# EAGLE design SP (EAGLE 9.4.2)
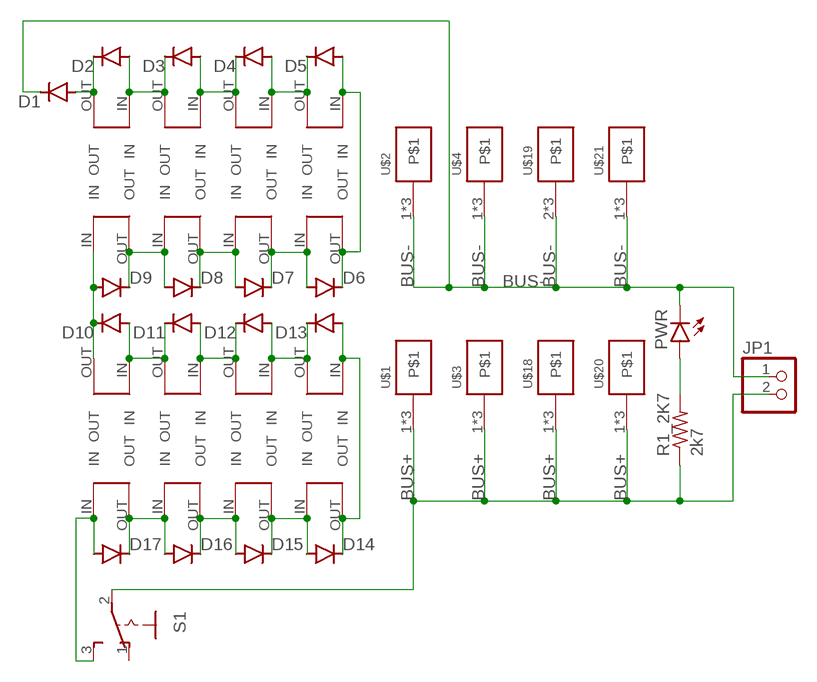
[diagram p0: schematic, sheet 1]

## Parts
D1  MBR0520LT  [SOD123]
D2  MBR0520LT  [SOD123]
D3  MBR0520LT  [SOD123]
D4  MBR0520LT  [SOD123]
D5  MBR0520LT  [SOD123]
D6  MBR0520LT  [SOD123]
D7  MBR0520LT  [SOD123]
D8  MBR0520LT  [SOD123]
D9  MBR0520LT  [SOD123]
D10  MBR0520LT  [SOD123]
D11  MBR0520LT  [SOD123]
D12  MBR0520LT  [SOD123]
D13  MBR0520LT  [SOD123]
D14  MBR0520LT  [SOD123]
D15  MBR0520LT  [SOD123]
D16  MBR0520LT  [SOD123]
D17  MBR0520LT  [SOD123]
JP1  PINHD-1X2  [1X02]
PWR  LEDCHIPLED_0603  [CHIPLED_0603]
R1_2K7  2k7  R-US_R0603  [R0603]
S1  255SB  [255SB]
SOL1  SOLAR_0  [SOLAR_0]
SOL2  SOLAR_0  [SOLAR_0]
SOL3  SOLAR_0  [SOLAR_0]
SOL4  SOLAR_1  [SOLAR_1]
SOL5  SOLAR_0  [SOLAR_0]
SOL6  SOLAR_0  [SOLAR_0]
SOL7  SOLAR_0  [SOLAR_0]
SOL8  SOLAR_1  [SOLAR_1]
SOL9  SOLAR_0  [SOLAR_0]
SOL10  SOLAR_0  [SOLAR_0]
SOL11  SOLAR_0  [SOLAR_0]
SOL12  SOLAR_1  [SOLAR_1]
SOL13  SOLAR_0  [SOLAR_0]
SOL14  SOLAR_0  [SOLAR_0]
SOL15  SOLAR_0  [SOLAR_0]
SOL16  SOLAR_1  [SOLAR_1]
U$1  KCONNECT3  [KCONNECT-3]
U$2  KCONNECT3  [KCONNECT-3]
U$3  KCONNECT4  [KCONNECT-4]
U$4  KCONNECT4  [KCONNECT-4]
U$18  KCONNECT4  [KCONNECT-4]
U$19  KCONNECT1  [KCONNECT-1]
U$20  KCONNECT3  [KCONNECT-3]
U$21  KCONNECT3  [KCONNECT-3]

## Nets
BUS+: JP1.2 R1_2K7.1 S1.2(P) U$1.1 U$1.2 U$1.4 U$3.1 U$3.2 U$3.3 U$18.1 U$18.2 U$18.3 U$20.1 U$20.2 U$20.4
BUS-: D1.C JP1.1 PWR.C U$2.1 U$2.2 U$2.4 U$4.1 U$4.2 U$4.3 U$19.2 U$19.3 U$19.4 U$21.1 U$21.2 U$21.4
N$1: D16.A D17.C SOL1.OUT SOL2.IN
N$3: D15.A D16.C SOL2.OUT SOL3.IN
N$4: D1.A D2.C SOL16.OUT
N$5: PWR.A R1_2K7.2
N$6: D14.A D15.C SOL3.OUT SOL4.IN
N$7: D17.A S1.3(S) SOL1.IN
N$8: D12.A D13.C SOL5.OUT SOL6.IN
N$9: D11.A D12.C SOL6.OUT SOL7.IN
N$10: D10.A D11.C SOL7.OUT SOL8.IN
N$11: D9.A D10.C SOL8.OUT SOL9.IN
N$12: D8.A D9.C SOL9.OUT SOL10.IN
N$13: D7.A D8.C SOL10.OUT SOL11.IN
N$14: D6.A D7.C SOL11.OUT SOL12.IN
N$15: D5.A D6.C SOL12.OUT SOL13.IN
N$16: D4.A D5.C SOL13.OUT SOL14.IN
N$17: D3.A D4.C SOL14.OUT SOL15.IN
N$18: D2.A D3.C SOL15.OUT SOL16.IN
N$24: D13.A D14.C SOL4.OUT SOL5.IN
Unconnected: S1.1(O)

## Library data of the parts
D1-D17 = diode:MBR0520LT: SCHOTTKY BARRIER RECTIFIER Source: http://onsemi.com .. MBR0520LT1-D.pdf
JP1 = pinhead:PINHD-1X2: PIN HEADER
PWR = led:LED: LED OSRAM: - CHIPLED LG R971, LG N971, LY N971, LG Q971, LY Q971, LO R971, LY R971 LH N974, LH R974 LS Q976, LO Q976, LY Q976 LO Q996 - Hyper CHIPLED LW Q18S LB Q993, LB Q99A, LB R99A - SideLED LS A670, LO A670, LY A670, LG A670, LP A670 LB A673, LV A673, LT A673, LW A673 LH A674 LY A675 LS A676, LA A676, LO A676, LY A676, LW A676 LS A679, LY A679, LG A679 - Hyper Micro SIDELED® LS Y876, LA Y876, LO Y876, LY Y876 LT Y87S - SmartLED LW L88C, LW L88S LB L89C, LB L89S, LG L890 LS L89K, LO L89K, LY L89K LS L896, LA L896, LO L896, LY L896 - TOPLED LS T670, LO T670, LY T670, LG T670, LP T670 LSG T670, LSP T670, LSY T670, LOP T670, LYG T670 LG T671, LOG T671, LSG T671 LB T673, LV T673, LT T673, LW T673 LH T674 LS T676, LA T676, LO T676, LY T676, LB T676, LH T676, LSB T676, LW T676 LB T67C, LV T67C, LT T67C, LS T67K, LO T67K, LY T67K, LW E67C LS E67B, LA E67B, LO E67B, LY E67B, LB E67C, LV E67C, LT E67C LW T67C LS T679, LY T679, LG T679 LS T770, LO T770, LY T770, LG T770, LP T770 LB T773, LV T773, LT T773, LW T773 LH T774 LS E675, LA E675, LY E675, LS T675 LS T776, LA T776, LO T776, LY T776, LB T776 LHGB T686 LT T68C, LB T68C - Hyper Mini TOPLED® LB M676 - Mini TOPLED Santana® LG M470 LS M47K, LO M47K, LY M47K Source: http://www.osram.convergy.de LUXEON: - LUMILED® LXK2-PW12-R00, LXK2-PW12-S00, LXK2-PW14-U00, LXK2-PW14-V00 LXK2-PM12-R00, LXK2-PM12-S00, LXK2-PM14-U00 LXK2-PE12-Q00, LXK2-PE12-R00, LXK2-PE12-S00, LXK2-PE14-T00, LXK2-PE14-U00 LXK2-PB12-K00, LXK2-PB12-L00, LXK2-PB12-M00, LXK2-PB14-N00, LXK2-PB14-P00, LXK2-PB14-Q00 LXK2-PR12-L00, LXK2-PR12-M00, LXK2-PR14-Q00, LXK2-PR14-R00 LXK2-PD12-Q00, LXK2-PD12-R00, LXK2-PD12-S00 LXK2-PH12-R00, LXK2-PH12-S00 LXK2-PL12-P00, LXK2-PL12-Q00, LXK2-PL12-R00 Source: www.luxeon.com KINGBRIGHT: KA-3528ASYC Source: www.kingbright.com
R1_2K7 = rcl:R-US_: RESISTOR, American symbol; SPICEPREFIX: R
S1 = CanCubeSat:255SB: SLIDING SWITCH Distributor Buerklin, 11G810
SOL1-SOL16 = CanCubeSat:SOLAR
U$1-U$4 U$18-U$21 = CanCubeSat:KCONNECT

## Board
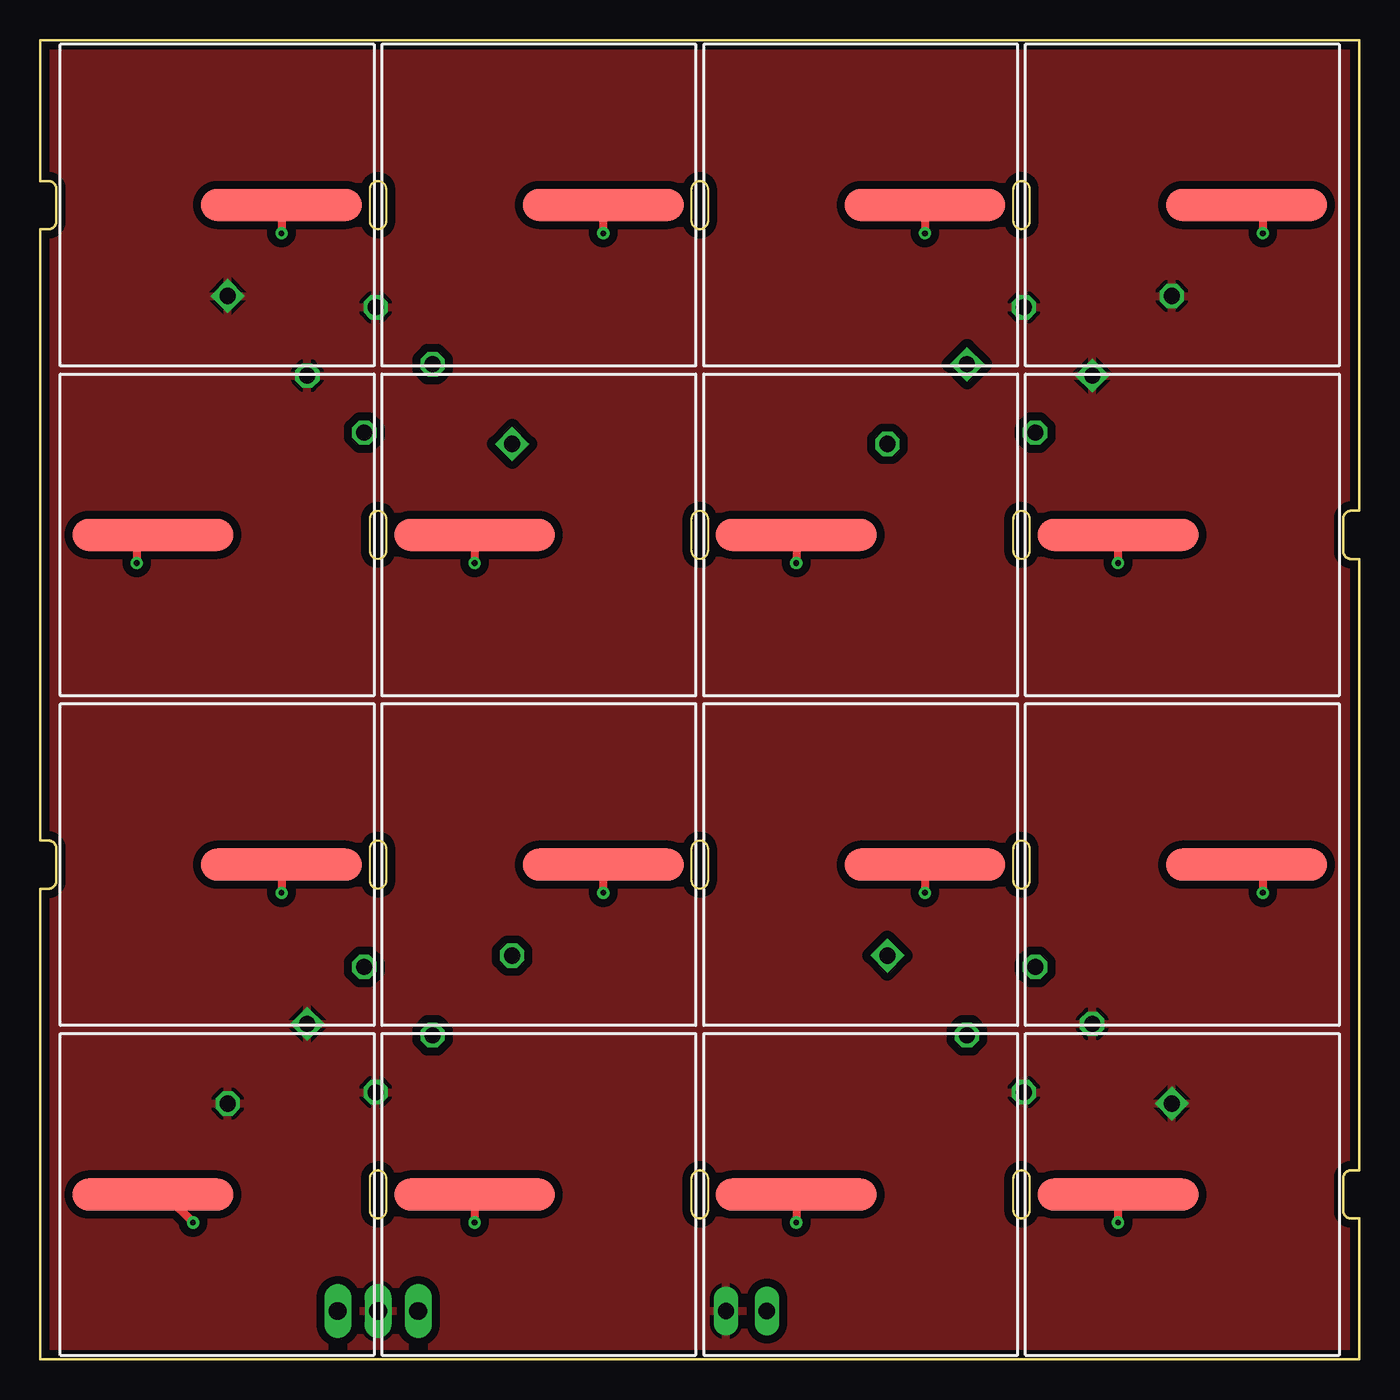
[diagram p1: board, top side]
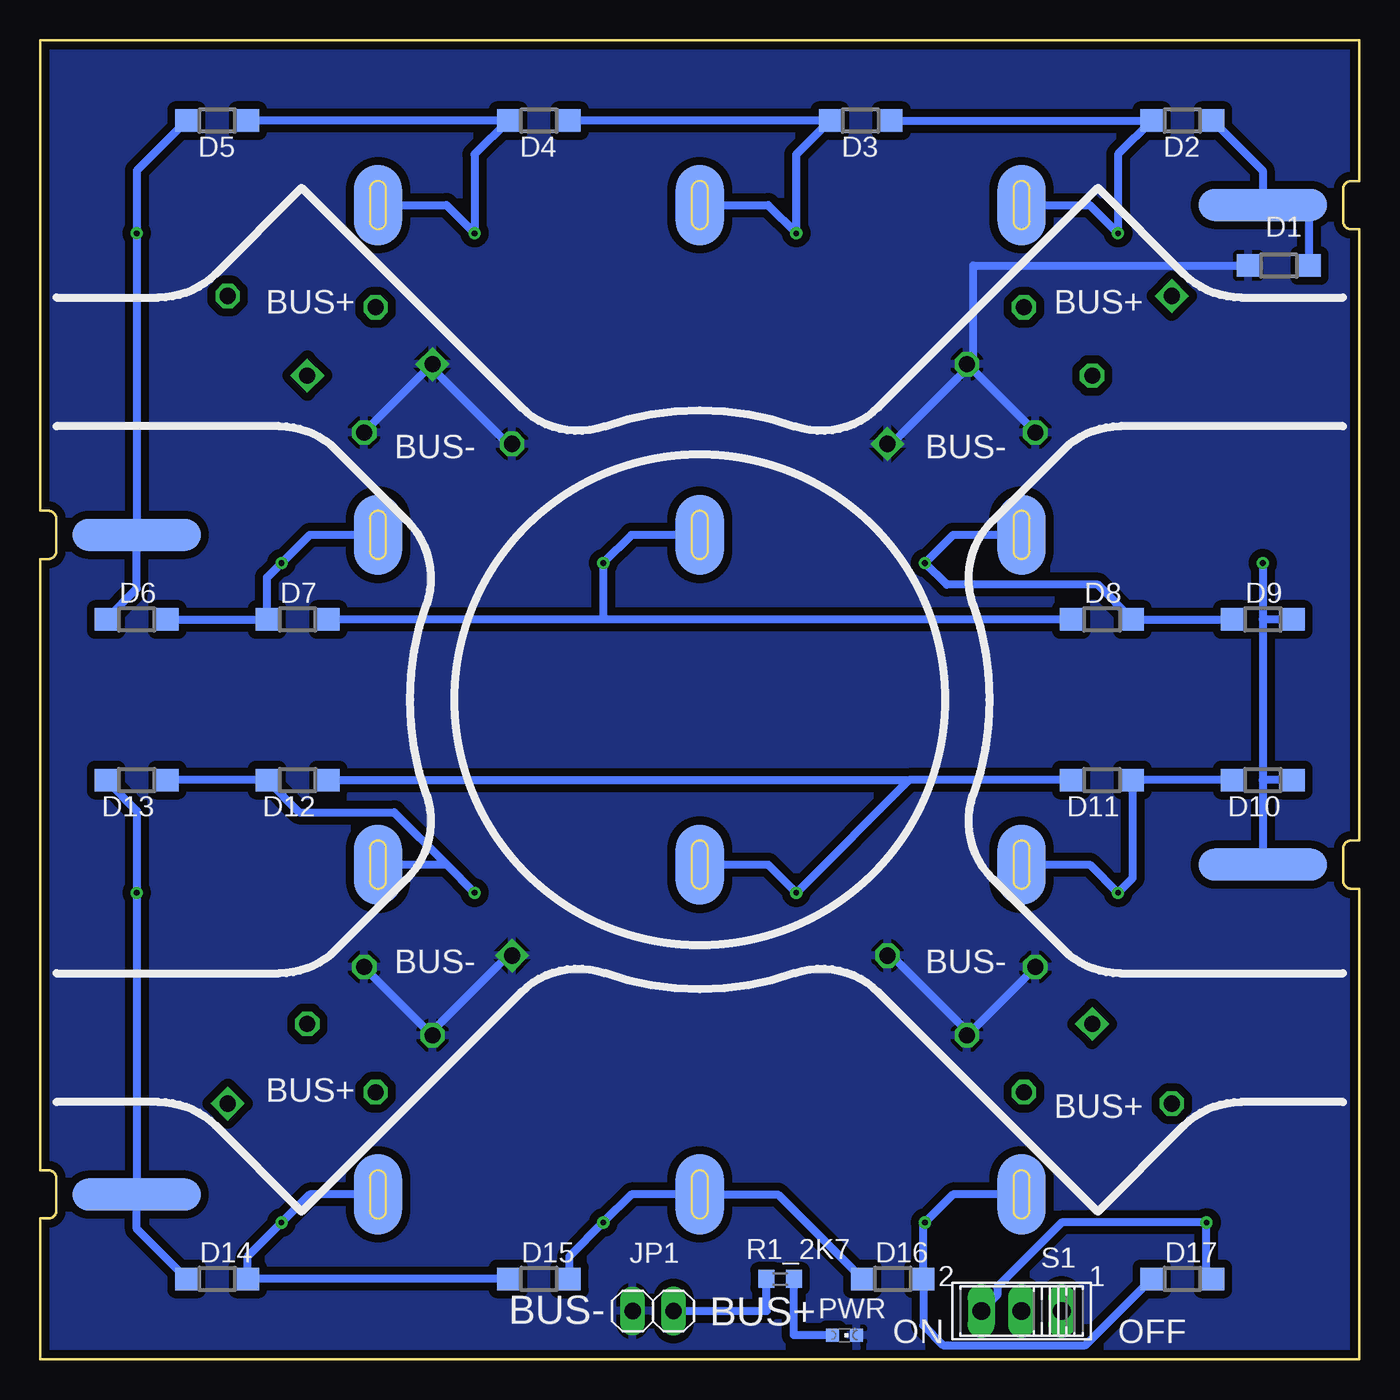
[diagram p2: board, bottom side, seen from below]

Size 82 x 82 mm. Coordinates in mm from the lower left corner, seen from the top.
Outline: 0,0 82,0 82,8.75 81.5,8.75 arc-90 81,9.25 81,11.25 arc-90 81.5,11.75 82,11.75 82,49.75 81.5,49.75 arc-90 81,50.25 81,52.25 arc-90 81.5,52.75 82,52.75 82,82 0,82 0,73.25 0.5,73.25 arc-90 1,72.75 1,70.75 arc-90 0.5,70.25 0,70.25 0,32.25 0.5,32.25 arc-90 1,31.75 1,29.75 arc-90 0.5,29.25 0,29.25 0,0
Copper layers (1*16): Top 0.035mm / dielectric 1.5mm / Bottom 0.035mm
Design rules "default *": minimum track width 0.5mm, minimum drill 0.35mm, track to track 0.2mm, track to pad 0.2mm, pad to pad 0.2mm, via to via 0.2mm, smd to smd 0.2mm, copper to edge 0.35mm, drill to drill 6mil, minimum pad ring 10mil, minimum via ring 8mil, stop-mask expansion 2mil, vias tented up to drill 0mil, thermal gap 10mil

### Footprints (pad centres in the part's own frame; a part is rotated, then mirrored left to right if it is on the bottom)
SOD123 = smd 1.4 x 1.4: A 1.9,0; C -1.9,0
1X02 = drill 1.016 long: 1 -1.27,0; 2 1.27,0
CHIPLED_0603 = smd 0.8 x 0.8: A 0,-0.75; C 0,0.75
R0603 = smd 1 x 1.1: 1 -0.85,0; 2 0.85,0
255SB = drill 1.118 long: 1 -2.5,0; 2 0,0; 3 2.5,0
SOLAR_0 = smd 2 x 10: IN 0,-4 | smd 5 x 3 bottom: OUT 0,10
SOLAR_1 = smd 2 x 10: IN 0,-4 | smd 2 x 8 bottom: OUT 0,5
KCONNECT-3 = drill 1 pad 1.4 square: 1 -3,-3.5 | drill 1 pad 1.4 octagon: 2 -3,3.5; 4 3,3.5
KCONNECT-4 = drill 1 pad 1.4 square: 1 -3,-3.5 | drill 1 pad 1.4 octagon: 2 -3,3.5; 3 3,-3.5
KCONNECT-1 = drill 1 pad 1.4 octagon: 2 -3,3.5; 3 3,-3.5; 4 3,3.5

### Placement (x,y rotation side)
D1  5,68 0 bottom
D2  11,77 180 bottom
D3  31,77 180 bottom
D4  51,77 180 bottom
D5  71,77 180 bottom
D6  76,46 0 bottom
D7  66,46 0 bottom
D8  16,46 0 bottom
D9  6,46 0 bottom
D10  6,36 180 bottom
D11  16,36 180 bottom
D12  66,36 180 bottom
D13  76,36 180 bottom
D14  71,5 0 bottom
D15  51,5 0 bottom
D16  29,5 0 bottom
D17  11,5 0 bottom
JP1  43.9,3 0 bottom
PWR  32,1.5 270 bottom
R1_2K7  36,5 0 bottom
S1  21,3 180 bottom
SOL1  11,10.25 270 top
SOL2  31,10.25 270 top
SOL3  51,10.25 270 top
SOL4  71,10.25 270 top
SOL5  71,30.75 90 top
SOL6  51,30.75 90 top
SOL7  31,30.75 90 top
SOL8  11,30.75 90 top
SOL9  11,51.25 270 top
SOL10  31,51.25 270 top
SOL11  51,51.25 270 top
SOL12  71,51.25 270 top
SOL13  71,71.75 90 top
SOL14  51,71.75 90 top
SOL15  31,71.75 90 top
SOL16  11,71.75 90 top
U$1  16.25,65.75 135 bottom
U$2  24.74,57.26 315 bottom
U$3  65.75,65.75 45 bottom
U$4  57.26,57.26 225 bottom
U$18  16.25,16.25 225 bottom
U$19  24.74,24.74 225 bottom
U$20  65.75,16.25 315 bottom
U$21  57.26,24.74 135 bottom

### Tracks (layer width: path | path; a pad name or v marks a point on that pad's centre or on a via)
BUS+
  Bottom 0.5: JP1.2 36.85,3 R1_2K7.1
  pour Top (isolate 0.5): 84.2,-1.8 84.2,85.1 -2.7,85.1 -2.7,-1.8
BUS-
  Bottom 0.5: U$4.2 53,57 57.5,61.5 U$4.1 58,61.5 61.5,58 U$4.3 | D1.C 24,68 24,62 U$2.2 | U$2.4 20.5,58 24,61.5 U$2.2 | U$2.1 29,57 24.5,61.5 U$2.2 | 45,3 JP1.1 | U$19.2 20.5,24 24,20.5 U$19.4 24.5,20.5 29,25 U$19.3 | U$21.4 61.5,24 58,20.5 U$21.2 57.5,20.5 53,25 U$21.1
  pour Bottom (isolate 0.5): -14.1,-8.2 89.7,-8.2 89.7,91.3 -14.1,91.3
N$1  (via drill 0.35)
  Top 0.5: SOL2.IN v27,8.5
  Bottom 0.5: SOL1.OUT 25.25,10.25 v27,8.5 27.1,8.4 D16.A 27.1,2.1 25.87,0.87 17.03,0.87 D17.C
N$3  (via drill 0.35)
  Top 0.5: SOL3.IN v47,8.5
  Bottom 0.5: D15.A 49.1,6.4 v47,8.5 45.25,10.25 SOL2.OUT 36.15,10.25 D16.C
N$4
  Bottom 0.5: D1.A 3.1,71.75 SOL16.OUT 6,73.9 D2.C
N$5
  Bottom 0.5: PWR.A 35.15,1.5 R1_2K7.2
N$6  (via drill 0.35)
  Top 0.5: SOL4.IN v67,8.5
  Bottom 0.5: SOL3.OUT 65.25,10.25 v67,8.5 69.1,6.4 D14.A D15.C
N$7  (via drill 0.35)
  Top 0.5: v9.5,8.5 8,10 7,10 SOL1.IN
  Bottom 0.5: S1.3 22.5,4 22.5,4.5 18.5,8.5 v9.5,8.5 9.5,5.4 D17.A
N$8  (via drill 0.35)
  Top 0.5: SOL6.IN v55,29
  Bottom 0.5: SOL5.OUT 56.75,30.75 | 56.75,30.75 v55,29 | 56.75,30.75 60,34 65.9,34 D12.A D13.C
N$9  (via drill 0.35)
  Top 0.5: SOL7.IN v35,29
  Bottom 0.5: SOL6.OUT 36.75,30.75 v35,29 28,36 | D11.A 28,36 | D12.C 28,36
N$10  (via drill 0.35)
  Top 0.5: SOL8.IN v15,29
  Bottom 0.5: SOL7.OUT 16.75,30.75 v15,29 14.1,29.9 D11.C D10.A
N$11  (via drill 0.35)
  Top 0.5: v6,49.5 6,51 7,51 SOL9.IN
  Bottom 0.5: v6,49.5 6,46 | 6,46 6,36 | 6,36 SOL8.OUT | D9.A 6,46 | D10.C 6,36
N$12  (via drill 0.35)
  Top 0.5: SOL10.IN v27,49.5
  Bottom 0.5: SOL9.OUT 25.25,51.25 v27,49.5 25.65,48.15 16.25,48.15 D8.A D9.C
N$13  (via drill 0.35)
  Top 0.5: SOL11.IN v47,49.5
  Bottom 0.5: SOL10.OUT 45.25,51.25 v47,49.5 47,46 | D8.C 47,46 | 47,46 D7.A
N$14  (via drill 0.35)
  Top 0.5: SOL12.IN v67,49.5
  Bottom 0.5: SOL11.OUT 65.25,51.25 v67,49.5 67.9,48.6 D7.C D6.A
N$15  (via drill 0.35)
  Top 0.5: v76,70 76,71.5 75,71.5 SOL13.IN
  Bottom 0.5: D5.A 76,73.9 v76,70 SOL12.OUT 76,47.9 D6.C
N$16  (via drill 0.35)
  Top 0.5: SOL14.IN v55,70
  Bottom 0.5: SOL13.OUT 56.75,71.75 v55,70 55,74.9 D4.A D5.C
N$17  (via drill 0.35)
  Top 0.5: SOL15.IN v35,70
  Bottom 0.5: SOL14.OUT 36.75,71.75 v35,70 35,74.9 D3.A D4.C
N$18  (via drill 0.35)
  Top 0.5: SOL16.IN v15,70
  Bottom 0.5: SOL15.OUT 16.75,71.75 v15,70 15,74.9 D2.A D3.C
N$24  (via drill 0.35)
  Top 0.5: v76,29 76,30.5 75,30.5 SOL5.IN
  Bottom 0.5: D13.A 76,34.1 v76,29 SOL4.OUT 76,8.1 D14.C

### Text on the board
bNames: BUS+ | BUS+ | BUS- | BUS- | BUS- | BUS- | BUS+ | BUS+ | BUS+ | BUS- | OFF | ON